# Altium schematic sheet Mosfet_cct.SchDoc
size A1
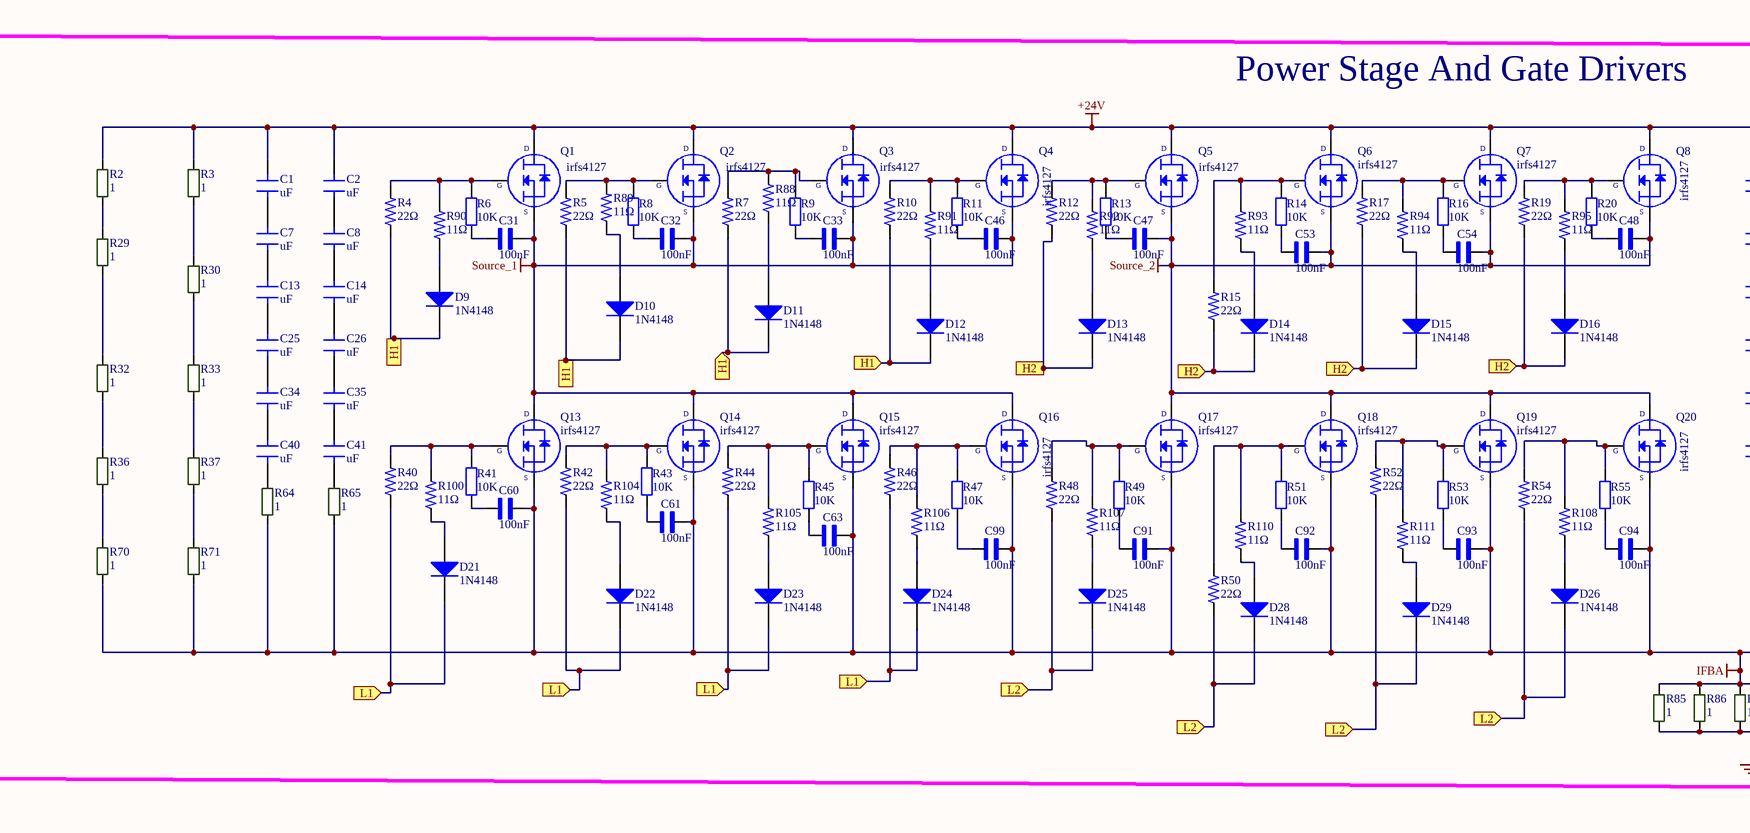
[diagram p0: Mosfet_cct.SchDoc, left]
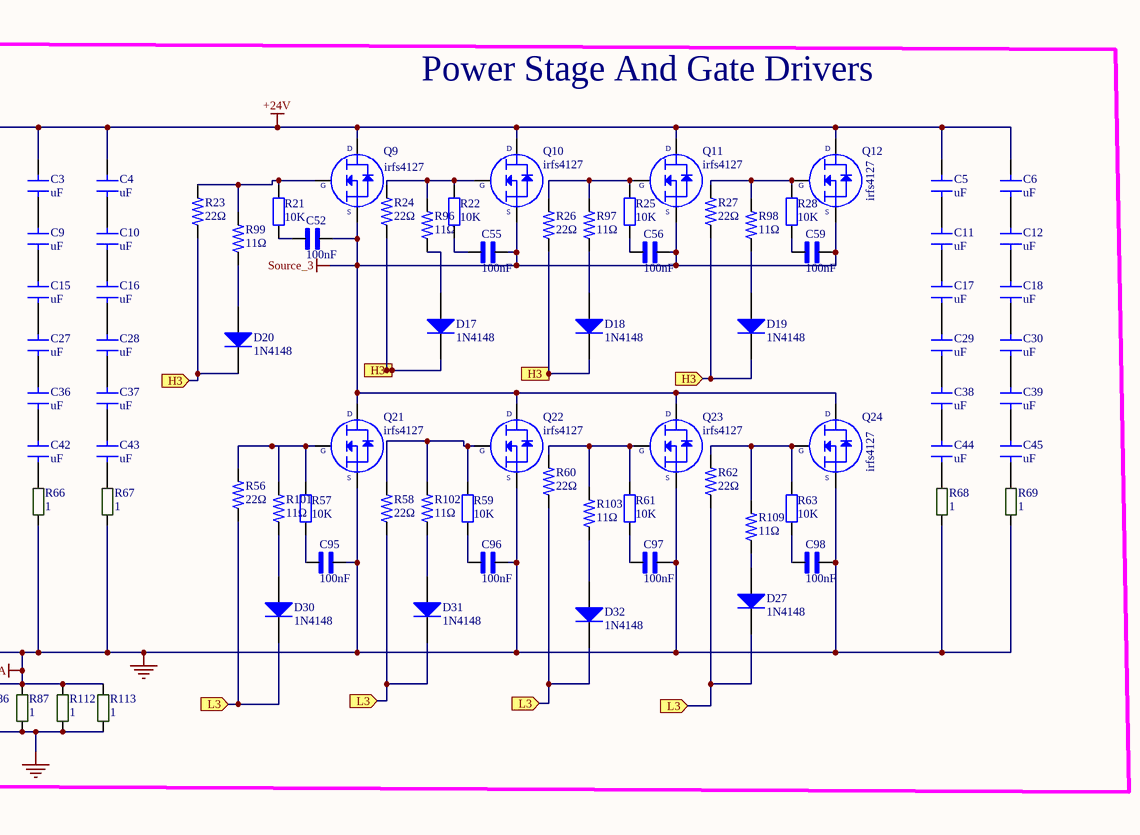
[diagram p1: Mosfet_cct.SchDoc, right]

## Parts
C1  uF  [C-1206]
C2  uF  [C-1206]
C3  uF  [C-1206]
C4  uF  [C-1206]
C5  uF  [C-1206]
C6  uF  [C-1206]
C7  uF  [C-1206]
C8  uF  [C-1206]
C9  uF  [C-1206]
C10  uF  [C-1206]
C11  uF  [C-1206]
C12  uF  [C-1206]
C13  uF  [C-1206]
C14  uF  [C-1206]
C15  uF  [C-1206]
C16  uF  [C-1206]
C17  uF  [C-1206]
C18  uF  [C-1206]
C25  uF  [C-1206]
C26  uF  [C-1206]
C27  uF  [C-1206]
C28  uF  [C-1206]
C29  uF  [C-1206]
C30  uF  [C-1206]
C31  100nF  [C-0805W]
C32  100nF  [C-0805W]
C33  100nF  [C-0805W]
C34  uF  [C-1206]
C35  uF  [C-1206]
C36  uF  [C-1206]
C37  uF  [C-1206]
C38  uF  [C-1206]
C39  uF  [C-1206]
C40  uF  [C-1206]
C41  uF  [C-1206]
C42  uF  [C-1206]
C43  uF  [C-1206]
C44  uF  [C-1206]
C45  uF  [C-1206]
C46  100nF  [C-0805W]
C47  100nF  [C-0805W]
C48  100nF  [C-0805W]
C52  100nF  [C-0805W]
C53  100nF  [C-0805W]
C54  100nF  [C-0805W]
C55  100nF  [C-0805W]
C56  100nF  [C-0805W]
C59  100nF  [C-0805W]
C60  100nF  [C-0805W]
C61  100nF  [C-0805W]
C63  100nF  [C-0805W]
C91  100nF  [C-0805W]
C92  100nF  [C-0805W]
C93  100nF  [C-0805W]
C94  100nF  [C-0805W]
C95  100nF  [C-0805W]
C96  100nF  [C-0805W]
C97  100nF  [C-0805W]
C98  100nF  [C-0805W]
C99  100nF  [C-0805W]
D9  1N4148 Diyot  [SOD-123]  (value not drawn)
D10  1N4148 Diyot  [SOD-123]  (value not drawn)
D11  1N4148 Diyot  [SOD-123]  (value not drawn)
D12  1N4148 Diyot  [SOD-123]  (value not drawn)
D13  1N4148 Diyot  [SOD-123]  (value not drawn)
D14  1N4148 Diyot  [SOD-123]  (value not drawn)
D15  1N4148 Diyot  [SOD-123]  (value not drawn)
D16  1N4148 Diyot  [SOD-123]  (value not drawn)
D17  1N4148 Diyot  [SOD-123]  (value not drawn)
D18  1N4148 Diyot  [SOD-123]  (value not drawn)
D19  1N4148 Diyot  [SOD-123]  (value not drawn)
D20  1N4148 Diyot  [SOD-123]  (value not drawn)
D21  1N4148 Diyot  [SOD-123]  (value not drawn)
D22  1N4148 Diyot  [SOD-123]  (value not drawn)
D23  1N4148 Diyot  [SOD-123]  (value not drawn)
D24  1N4148 Diyot  [SOD-123]  (value not drawn)
D25  1N4148 Diyot  [SOD-123]  (value not drawn)
D26  1N4148 Diyot  [SOD-123]  (value not drawn)
D27  1N4148 Diyot  [SOD-123]  (value not drawn)
D28  1N4148 Diyot  [SOD-123]  (value not drawn)
D29  1N4148 Diyot  [SOD-123]  (value not drawn)
D30  1N4148 Diyot  [SOD-123]  (value not drawn)
D31  1N4148 Diyot  [SOD-123]  (value not drawn)
D32  1N4148 Diyot  [SOD-123]  (value not drawn)
Q1  irfs4127  [DPAK_TO263]
Q2  irfs4127  [DPAK_TO263]
Q3  irfs4127  [DPAK_TO263]
Q4  irfs4127  [DPAK_TO263]
Q5  irfs4127  [DPAK_TO263]
Q6  irfs4127  [DPAK_TO263]
Q7  irfs4127  [DPAK_TO263]
Q8  irfs4127  [DPAK_TO263]
Q9  irfs4127  [DPAK_TO263]
Q10  irfs4127  [DPAK_TO263]
Q11  irfs4127  [DPAK_TO263]
Q12  irfs4127  [DPAK_TO263]
Q13  irfs4127  [DPAK_TO263]
Q14  irfs4127  [DPAK_TO263]
Q15  irfs4127  [DPAK_TO263]
Q16  irfs4127  [DPAK_TO263]
Q17  irfs4127  [DPAK_TO263]
Q18  irfs4127  [DPAK_TO263]
Q19  irfs4127  [DPAK_TO263]
Q20  irfs4127  [DPAK_TO263]
Q21  irfs4127  [DPAK_TO263]
Q22  irfs4127  [DPAK_TO263]
Q23  irfs4127  [DPAK_TO263]
Q24  irfs4127  [DPAK_TO263]
R2  1  [R-2512W]
R3  1  [R-2512W]
R4  22Ω  [R-1206W]
R5  22Ω  [R-1206W]
R6  Deger: 10K  [R-0805W]  (hidden comment: RES SMD 10K OHM 1% 1/8W 0805)
R7  22Ω  [R-1206W]
R8  Deger: 10K  [R-0805W]  (hidden comment: RES SMD 10K OHM 1% 1/8W 0805)
R9  Deger: 10K  [R-0805W]  (hidden comment: RES SMD 10K OHM 1% 1/8W 0805)
R10  22Ω  [R-1206W]
R11  Deger: 10K  [R-0805W]  (hidden comment: RES SMD 10K OHM 1% 1/8W 0805)
R12  22Ω  [R-1206W]
R13  Deger: 10K  [R-0805W]  (hidden comment: RES SMD 10K OHM 1% 1/8W 0805)
R14  Deger: 10K  [R-0805W]  (hidden comment: RES SMD 10K OHM 1% 1/8W 0805)
R15  22Ω  [R-1206W]
R16  Deger: 10K  [R-0805W]  (hidden comment: RES SMD 10K OHM 1% 1/8W 0805)
R17  22Ω  [R-1206W]
R19  22Ω  [R-1206W]
R20  Deger: 10K  [R-0805W]  (hidden comment: RES SMD 10K OHM 1% 1/8W 0805)
R21  Deger: 10K  [R-0805W]  (hidden comment: RES SMD 10K OHM 1% 1/8W 0805)
R22  Deger: 10K  [R-0805W]  (hidden comment: RES SMD 10K OHM 1% 1/8W 0805)
R23  22Ω  [R-1206W]
R24  22Ω  [R-1206W]
R25  Deger: 10K  [R-0805W]  (hidden comment: RES SMD 10K OHM 1% 1/8W 0805)
R26  22Ω  [R-1206W]
R27  22Ω  [R-1206W]
R28  Deger: 10K  [R-0805W]  (hidden comment: RES SMD 10K OHM 1% 1/8W 0805)
R29  1  [R-2512W]
R30  1  [R-2512W]
R32  1  [R-2512W]
R33  1  [R-2512W]
R36  1  [R-2512W]
R37  1  [R-2512W]
R40  22Ω  [R-1206W]
R41  Deger: 10K  [R-0805W]  (hidden comment: RES SMD 10K OHM 1% 1/8W 0805)
R42  22Ω  [R-1206W]
R43  Deger: 10K  [R-0805W]  (hidden comment: RES SMD 10K OHM 1% 1/8W 0805)
R44  22Ω  [R-1206W]
R45  Deger: 10K  [R-0805W]  (hidden comment: RES SMD 10K OHM 1% 1/8W 0805)
R46  22Ω  [R-1206W]
R47  Deger: 10K  [R-0805W]  (hidden comment: RES SMD 10K OHM 1% 1/8W 0805)
R48  22Ω  [R-1206W]
R49  Deger: 10K  [R-0805W]  (hidden comment: RES SMD 10K OHM 1% 1/8W 0805)
R50  22Ω  [R-1206W]
R51  Deger: 10K  [R-0805W]  (hidden comment: RES SMD 10K OHM 1% 1/8W 0805)
R52  22Ω  [R-1206W]
R53  Deger: 10K  [R-0805W]  (hidden comment: RES SMD 10K OHM 1% 1/8W 0805)
R54  22Ω  [R-1206W]
R55  Deger: 10K  [R-0805W]  (hidden comment: RES SMD 10K OHM 1% 1/8W 0805)
R56  22Ω  [R-1206W]
R57  Deger: 10K  [R-0805W]  (hidden comment: RES SMD 10K OHM 1% 1/8W 0805)
R58  22Ω  [R-1206W]
R59  Deger: 10K  [R-0805W]  (hidden comment: RES SMD 10K OHM 1% 1/8W 0805)
R60  22Ω  [R-1206W]
R61  Deger: 10K  [R-0805W]  (hidden comment: RES SMD 10K OHM 1% 1/8W 0805)
R62  22Ω  [R-1206W]
R63  Deger: 10K  [R-0805W]  (hidden comment: RES SMD 10K OHM 1% 1/8W 0805)
R64  1  [R-2512W]
R65  1  [R-2512W]
R66  1  [R-2512W]
R67  1  [R-2512W]
R68  1  [R-2512W]
R69  1  [R-2512W]
R70  1  [R-2512W]
R71  1  [R-2512W]
R85  1  [R-2512W]
R86  1  [R-2512W]
R87  1  [R-2512W]
R88  11Ω  [R-1206W]
R89  11Ω  [R-1206W]
R90  11Ω  [R-1206W]
R91  11Ω  [R-1206W]
R92  11Ω  [R-1206W]
R93  11Ω  [R-1206W]
R94  11Ω  [R-1206W]
R95  11Ω  [R-1206W]
R96  11Ω  [R-1206W]
R97  11Ω  [R-1206W]
R98  11Ω  [R-1206W]
R99  11Ω  [R-1206W]
R100  11Ω  [R-1206W]
R101  11Ω  [R-1206W]
R102  11Ω  [R-1206W]
R103  11Ω  [R-1206W]
R104  11Ω  [R-1206W]
R105  11Ω  [R-1206W]
R106  11Ω  [R-1206W]
R107  11Ω  [R-1206W]
R108  11Ω  [R-1206W]
R109  11Ω  [R-1206W]
R110  11Ω  [R-1206W]
R111  11Ω  [R-1206W]
R112  1  [R-2512W]
R113  1  [R-2512W]

## Ports
H1 (in), H2 (in), H3 (in), L1 (in), L2 (in), L3 (in)

## Nets
+24V: C1.2 C2.2 C3.2 C4.2 C5.2 C6.2 Q1.3 Q2.3 Q3.3 Q4.3 Q5.3 Q6.3 Q7.3 Q8.3 Q9.3 Q10.3 Q11.3 Q12.3 R2.2 R3.2
GND: C60.2 C61.2 C63.2 C91.2 C92.2 C93.2 C94.2 C95.2 C96.2 C97.2 C98.2 C99.2 Q13.2 Q14.2 Q15.2 Q16.2 Q17.2 Q18.2 Q19.2 Q20.2 Q21.2 Q22.2 Q23.2 Q24.2 R64.1 R65.1 R66.1 R67.1 R68.1 R69.1 R70.1 R71.1 R85.1 R85.2 R86.1 R86.2 R87.1 R87.2 R112.1 R112.2 R113.1 R113.2  [also labelled IFBA]
Source_1: C31.2 C32.2 C33.2 C46.2 Q1.2 Q2.2 Q3.2 Q4.2 Q13.3 Q14.3 Q15.3 Q16.3
Source_2: C47.2 C48.2 C53.2 C54.2 Q5.2 Q6.2 Q7.2 Q8.2 Q17.3 Q18.3 Q19.3 Q20.3
Source_3: C52.2 C55.2 C56.2 C59.2 Q9.2 Q10.2 Q11.2 Q12.2 Q21.3 Q22.3 Q23.3 Q24.3
H1: D9.2(K) D10.2(K) D11.2(K) D12.2(K) R4.1 R5.1 R7.1 R10.1 ; port H1
H2: D13.2(K) D14.2(K) D15.2(K) D16.2(K) R12.1 R15.1 R17.1 R19.1 ; port H2
H3: D17.2(K) D18.2(K) D19.2(K) D20.2(K) R23.1 R24.1 R26.1 R27.1 ; port H3
L1: D21.2(K) D22.2(K) D23.2(K) D24.2(K) R40.1 R42.1 R44.1 R46.1 ; port L1
L2: D25.2(K) D26.2(K) D28.2(K) D29.2(K) R48.1 R50.1 R52.1 R54.1 ; port L2
L3: D27.2(K) D30.2(K) D31.2(K) D32.2(K) R56.1 R58.1 R60.1 R62.1 ; port L3
NetC1_1: C1.1 C7.2
NetC2_1: C2.1 C8.2
NetC3_1: C3.1 C9.2
NetC4_1: C4.1 C10.2
NetC5_1: C5.1 C11.2
NetC6_1: C6.1 C12.2
NetC7_1: C7.1 C13.2
NetC8_1: C8.1 C14.2
NetC9_1: C9.1 C15.2
NetC10_1: C10.1 C16.2
NetC11_1: C11.1 C17.2
NetC12_1: C12.1 C18.2
NetC13_1: C13.1 C25.2
NetC14_1: C14.1 C26.2
NetC15_1: C15.1 C27.2
NetC16_1: C16.1 C28.2
NetC17_1: C17.1 C29.2
NetC18_1: C18.1 C30.2
NetC25_1: C25.1 C34.2
NetC26_1: C26.1 C35.2
NetC27_1: C27.1 C36.2
NetC28_1: C28.1 C37.2
NetC29_1: C29.1 C38.2
NetC30_1: C30.1 C39.2
NetC31_1: C31.1 R6.1
NetC32_1: C32.1 R8.1
NetC33_1: C33.1 R9.1
NetC34_1: C34.1 C40.2
NetC35_1: C35.1 C41.2
NetC36_1: C36.1 C42.2
NetC37_1: C37.1 C43.2
NetC38_1: C38.1 C44.2
NetC39_1: C39.1 C45.2
NetC40_1: C40.1 R64.2
NetC41_1: C41.1 R65.2
NetC42_1: C42.1 R66.2
NetC43_1: C43.1 R67.2
NetC44_1: C44.1 R68.2
NetC45_1: C45.1 R69.2
NetC46_1: C46.1 R11.1
NetC47_1: C47.1 R13.1
NetC48_1: C48.1 R20.1
NetC52_1: C52.1 R21.1
NetC53_1: C53.1 R14.1
NetC54_1: C54.1 R16.1
NetC55_1: C55.1 R22.1
NetC56_1: C56.1 R25.1
NetC59_1: C59.1 R28.1
NetC60_1: C60.1 R41.1
NetC61_1: C61.1 R43.1
NetC63_1: C63.1 R45.1
NetC91_1: C91.1 R49.1
NetC92_1: C92.1 R51.1
NetC93_1: C93.1 R53.1
NetC94_1: C94.1 R55.1
NetC95_1: C95.1 R57.1
NetC96_1: C96.1 R59.1
NetC97_1: C97.1 R61.1
NetC98_1: C98.1 R63.1
NetC99_1: C99.1 R47.1
NetD9_1: D9.1(A) R90.1
NetD10_1: D10.1(A) R89.1
NetD11_1: D11.1(A) R88.1
NetD12_1: D12.1(A) R91.1
NetD13_1: D13.1(A) R92.1
NetD14_1: D14.1(A) R93.1
NetD15_1: D15.1(A) R94.1
NetD16_1: D16.1(A) R95.1
NetD17_1: D17.1(A) R96.1
NetD18_1: D18.1(A) R97.1
NetD19_1: D19.1(A) R98.1
NetD20_1: D20.1(A) R99.1
NetD21_1: D21.1(A) R100.1
NetD22_1: D22.1(A) R104.1
NetD23_1: D23.1(A) R105.1
NetD24_1: D24.1(A) R106.1
NetD25_1: D25.1(A) R107.1
NetD26_1: D26.1(A) R108.1
NetD27_1: D27.1(A) R109.1
NetD28_1: D28.1(A) R110.1
NetD29_1: D29.1(A) R111.1
NetD30_1: D30.1(A) R101.1
NetD31_1: D31.1(A) R102.1
NetD32_1: D32.1(A) R103.1
NetQ1_1: Q1.1 R4.2 R6.2 R90.2
NetQ2_1: Q2.1 R5.2 R8.2 R89.2
NetQ3_1: Q3.1 R7.2 R9.2 R88.2
NetQ4_1: Q4.1 R10.2 R11.2 R91.2
NetQ5_1: Q5.1 R12.2 R13.2 R92.2
NetQ6_1: Q6.1 R14.2 R15.2 R93.2
NetQ7_1: Q7.1 R16.2 R17.2 R94.2
NetQ8_1: Q8.1 R19.2 R20.2 R95.2
NetQ9_1: Q9.1 R21.2 R23.2 R99.2
NetQ10_1: Q10.1 R22.2 R24.2 R96.2
NetQ11_1: Q11.1 R25.2 R26.2 R97.2
NetQ12_1: Q12.1 R27.2 R28.2 R98.2
NetQ13_1: Q13.1 R40.2 R41.2 R100.2
NetQ14_1: Q14.1 R42.2 R43.2 R104.2
NetQ15_1: Q15.1 R44.2 R45.2 R105.2
NetQ16_1: Q16.1 R46.2 R47.2 R106.2
NetQ17_1: Q17.1 R48.2 R49.2 R107.2
NetQ18_1: Q18.1 R50.2 R51.2 R110.2
NetQ19_1: Q19.1 R52.2 R53.2 R111.2
NetQ20_1: Q20.1 R54.2 R55.2 R108.2
NetQ21_1: Q21.1 R56.2 R57.2 R101.2
NetQ22_1: Q22.1 R58.2 R59.2 R102.2
NetQ23_1: Q23.1 R60.2 R61.2 R103.2
NetQ24_1: Q24.1 R62.2 R63.2 R109.2
NetR2_1: R2.1 R29.2
NetR3_1: R3.1 R30.2
NetR29_1: R29.1 R32.2
NetR30_1: R30.1 R33.2
NetR32_1: R32.1 R36.2
NetR33_1: R33.1 R37.2
NetR36_1: R36.1 R70.2
NetR37_1: R37.1 R71.2

## Notes on the sheet
- Power Stage And Gate Drivers
- (in symbol IRFS4127TRLPBF) D; G; S

## Library data of the parts
C1-C18 C25-C30 C34-C45 = C-1206
C31-C33 C46-C48 C52-C56 C59-C61 C63 C91-C99 = CAP 100nF 50V SMT 0805: WCAP-CSGP General Purpose MLCC; SMT 0805; X7R; 100nF 10%; 50V; -55C to +125C; Tech. PN X7R0805104K050DFCT10000; MF: Wurth Electronics Inc; MP: 885012207098; Availability: Warning; Mouser-Purchase-URL: https://snapeda.com/shop?store=Mouser&id=4217223; Price: None; DigiKey-Purchase-URL: https://snapeda.com/shop?store=DigiKey&id=4217223; Package: 0805 Wurth Electronics; Value: *; SnapEDA_Link: https://www.snapeda.com/parts/885012207098/Wurth%20Electronics%20Inc/view-part/4217223/?ref=snap; BuyPart: https://www.snapeda.com/parts/885012207098/Wurth%20Electronics%20Inc/view-part/4217223/?ref=eda
D9-D32 = 1N4148: DIODE GEN PURP 100V 150MA SOD123; Uretici Kodu: 1N4148W-TP; -Sicaklik: -65; +Sicaklik: +150; Lehim Yöntemi: SMD; Cins: Diyot; Kılıf: SOD123; MSL: 1 (Unlimited); Deger: 1N4148
Q1-Q24 = IRFS4127TRLPBF: MOSFET N-CH 200V 72A D2PAK; Manufacturer: International Rectifier; Rds On Max: 22mR; Input Capacitance: 5.38nF; Rise Time: 18ns; Max Power Dissipation: 375W; Fall Time: 22ns; Turn-Off Delay Time: 56ns; Turn-On Delay Time: 17ns; Element Configuration: Single; Gate to Source Voltage (Vgs): 20V; Supplier 1: Digi-Key; Manufacturer Part Number: IRFS4127TRLPBF; RoHS: Yes; Stock 1: 15054; Pricing 1: 1 = 3,97000, 10 = 3,54100, 100 = 2,90330 (USD); Mount: Surface Mount; Case/Package: D2PAK; Number of Pins: 3; Min Operating Temperature: -55°C; Max Operating Temperature: 175°C; Package Quantity: 1; Packaging: Tape and Reel; Drain to Source Voltage (Vdss): 200V; Continuous Drain Current (ID): 72A; Drain to Source Breakdown Voltage: 200V; Drain to Source Resistance: 22mR; Power Dissipation: 375W; On-State Resistance: 22MR; ComponentLink1URL: https://datasheet.ciiva.com/939/irfs4127pbf-939456.pdf?src-supplier=Digi-Key; ComponentLink1Description: https://datasheet.ciiva.com/939/irfs4127pbf-939456.pdf?src-supplier=Digi-Key; ComponentLink2URL: https://datasheet.ciiva.com/939/irfs4127pbf-939457.pdf?src-supplier=Digi-Key; ComponentLink2Description: https://datasheet.ciiva.com/939/irfs4127pbf-939457.pdf?src-supplier=Digi-Key; ComponentLink3URL: https://datasheet.ciiva.com/939/irfs4127pbf-939458.pdf?src-supplier=Digi-Key; ComponentLink3Description: https://datasheet.ciiva.com/939/irfs4127pbf-939458.pdf?src-supplier=Digi-Key; ComponentLink4URL: https://datasheet.ciiva.com/16221/irfs4127pbf-16221031.pdf?src-supplier=Future+Electronics; ComponentLink4Description: https://datasheet.ciiva.com/16221/irfs4127pbf-16221031.pdf?src-supplier=Future+Electronics; Supplier Part Number 1: IRFS4127TRLPBFCT-ND
R2 R3 R29 R30 R32 R33 R36 R37 R64-R71 R85-R87 R112 R113 = 0207 melf: ComponentLink1Description: https://www.ozdisan.com/pasif-komponentler/direncler/smt-smd-direncler/M271UFG100KT20; ComponentLink1URL: https://www.ozdisan.com/pasif-komponentler/direncler/smt-smd-direncler/M271UFG100KT20
R4 R5 R7 R10 R12 R15 R17 R19 R23 R24 R26 R27 R40 R42 R44 R46 R48 R50 R52 R54 R56 R58 R60 R62 = RES 22Ω 1206: CRG1206 1% 22R; MP: 1623463-1; Package: None; Price: None; Value: *; Availability: Unavailable
R6 R8 R9 R11 R13 R14 R16 R20-R22 R25 R28 R41 R43 R45 R47 R49 R51 R53 R55 R57 R59 R61 R63 = 10K 0805: 10 kOhms ±1% 0.125W, 1/8W Chip Resistor 0805 (2012 Metric) Moisture Resistant Thick Film; Cins: Direnc; Kılıf: 0805; Uretici Kodu: RC0805FR-0710KL; -Sicaklik: -55; +Sicaklik: +155; Lehim Yöntemi: SMD; MSL: 1 (Unlimited)
R88-R111 = RES 11Ω 1206: CRG1206 1% 11R; MP: 1623463-1; Package: None; Price: None; Value: *; Availability: Unavailable